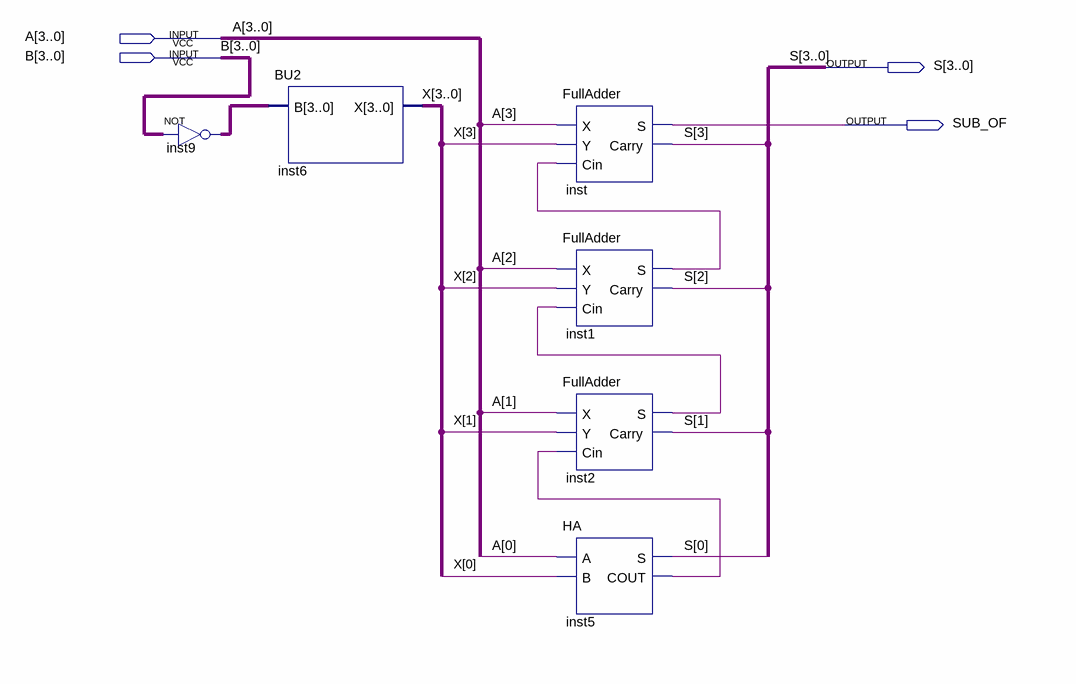
[diagram p0: schematic sheet]
// Quartus schematic TRU4BIT.bdf as structural Verilog: 6 symbols, 4 pins
module TRU4BIT (
  input  [3:0] A,
  input  [3:0] B,
  output [3:0] S,
  output SUB_OF
);

  wire inst1_s, inst2_s, inst5_cout;
  wire [3:0] inst9_out, X;

  assign inst9_out = ~B;  // NOT inst9, 4 bits wide
  BU2 inst6 (.B(inst9_out), .X(X));
  FullAdder inst (.X(A[3]), .Y(X[3]), .Cin(inst1_s), .S(SUB_OF), .Carry(S[3]));
  FullAdder inst1 (.X(A[2]), .Y(X[2]), .Cin(inst2_s), .S(inst1_s), .Carry(S[2]));
  FullAdder inst2 (.X(A[1]), .Y(X[1]), .Cin(inst5_cout), .S(inst2_s), .Carry(S[1]));
  HA inst5 (.A(A[0]), .B(X[0]), .S(S[0]), .COUT(inst5_cout));
endmodule
